# Altium project RFSoC-AMC.PrjPCB (part 22 of 22)
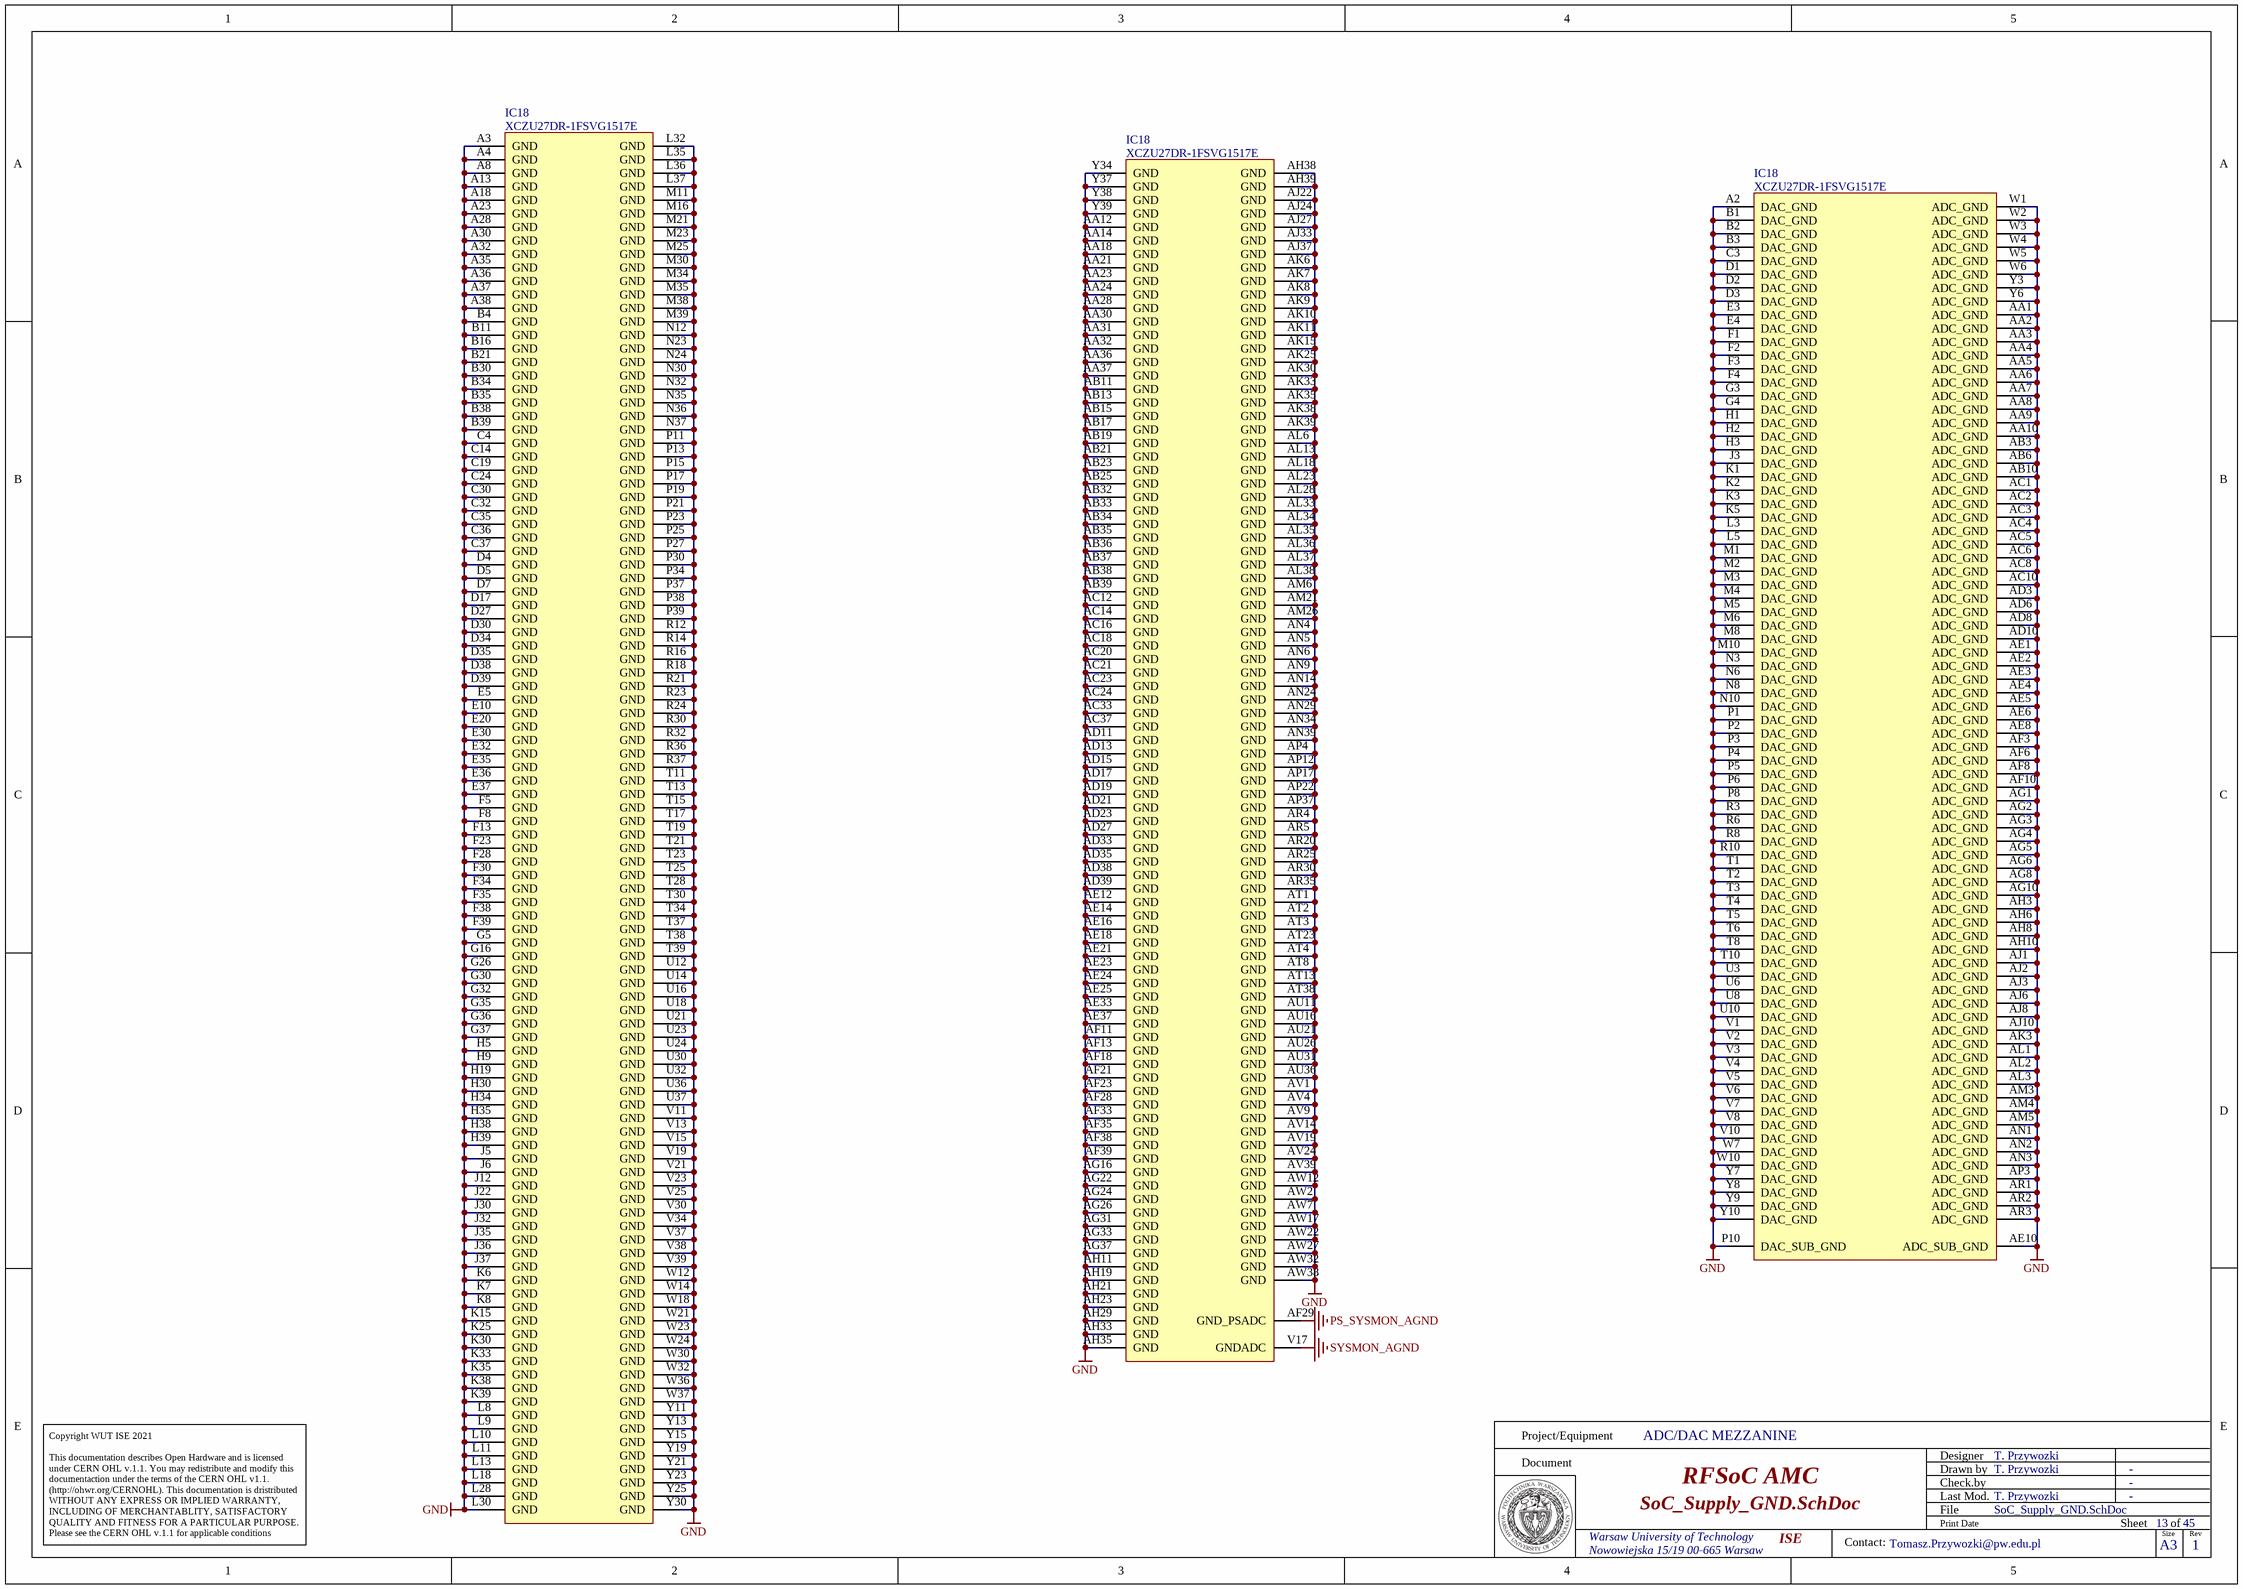
[diagram p48: SoC_Supply_GND.SchDoc]

## Nets that join several sheets (continued)
GTP8TX_N: RTM_Connector (J5.f2), SoC_FPGA_128-131_GTY (C492.2)
GTP8TX_P: RTM_Connector (J5.e2), SoC_FPGA_128-131_GTY (C494.2)
GTP9RX_N: RTM_Connector (J5.d1), SoC_FPGA_128-131_GTY (C463.2)
GTP9RX_P: RTM_Connector (J5.c1), SoC_FPGA_128-131_GTY (C464.2)
GTP9TX_N: RTM_Connector (J5.f1), SoC_FPGA_128-131_GTY (C465.2)
GTP9TX_P: RTM_Connector (J5.e1), SoC_FPGA_128-131_GTY (C466.2)
GTP10RX_N: RTM_Connector (J4.d10), SoC_FPGA_128-131_GTY (C459.2)
GTP10RX_P: RTM_Connector (J4.c10), SoC_FPGA_128-131_GTY (C460.2)
GTP10TX_N: RTM_Connector (J4.f10), SoC_FPGA_128-131_GTY (C461.2)
GTP10TX_P: RTM_Connector (J4.e10), SoC_FPGA_128-131_GTY (C462.2)
GTP11RX_N: RTM_Connector (J4.d9), SoC_FPGA_128-131_GTY (C324.2)
GTP11RX_P: RTM_Connector (J4.c9), SoC_FPGA_128-131_GTY (C338.2)
GTP11TX_N: RTM_Connector (J4.f9), SoC_FPGA_128-131_GTY (C456.2)
GTP11TX_P: RTM_Connector (J4.e9), SoC_FPGA_128-131_GTY (C458.2)
GTP12-15_CLK_IN_N: RTM_Connector (J4.b7), SoC_FPGA_128-131_GTY (C862.2)
GTP12-15_CLK_IN_P: RTM_Connector (J4.a7), SoC_FPGA_128-131_GTY (C864.2)
GTP12-15_CLK_OUT_N: RTM_Connector (J4.b8), SoC_FPGA_128-131_GTY (IC23.2)
GTP12-15_CLK_OUT_P: RTM_Connector (J4.a8), SoC_FPGA_128-131_GTY (IC23.1)
GTP12RX_N: RTM_Connector (J4.d8), SoC_FPGA_128-131_GTY (C508.1)
GTP12RX_P: RTM_Connector (J4.c8), SoC_FPGA_128-131_GTY (C511.1)
GTP12TX_N: RTM_Connector (J4.f8), SoC_FPGA_128-131_GTY (C509.1)
GTP12TX_P: RTM_Connector (J4.e8), SoC_FPGA_128-131_GTY (C512.1)
GTP13RX_N: RTM_Connector (J4.d7), SoC_FPGA_128-131_GTY (C515.1)
GTP13RX_P: RTM_Connector (J4.c7), SoC_FPGA_128-131_GTY (C517.1)
GTP13TX_N: RTM_Connector (J4.f7), SoC_FPGA_128-131_GTY (C516.1)
GTP13TX_P: RTM_Connector (J4.e7), SoC_FPGA_128-131_GTY (C518.1)
GTP14RX_N: RTM_Connector (J4.d6), SoC_FPGA_128-131_GTY (C519.1)
GTP14RX_P: RTM_Connector (J4.c6), SoC_FPGA_128-131_GTY (C521.1)
GTP14TX_N: RTM_Connector (J4.f6), SoC_FPGA_128-131_GTY (C520.1)
GTP14TX_P: RTM_Connector (J4.e6), SoC_FPGA_128-131_GTY (C765.1)
GTP15RX_N: RTM_Connector (J4.d5), SoC_FPGA_128-131_GTY (C321.2)
GTP15RX_P: RTM_Connector (J4.c5), SoC_FPGA_128-131_GTY (C326.2)
GTP15TX_N: RTM_Connector (J4.f5), SoC_FPGA_128-131_GTY (C455.2)
GTP15TX_P: RTM_Connector (J4.e5), SoC_FPGA_128-131_GTY (C457.2)
GTR_REF_N: SoC_PS_505_GTR (IC38.10), Clocking_SI5341B (IC83.53)
GTR_REF_P: SoC_PS_505_GTR (IC38.11), Clocking_SI5341B (IC83.54)
GTY_REF_128_N: SoC_FPGA_128-131_GTY (IC29.10), Clocking_SI5341B (IC83.30)
GTY_REF_128_P: SoC_FPGA_128-131_GTY (IC29.11), Clocking_SI5341B (IC83.31)
GTY_REF_129_N: SoC_FPGA_128-131_GTY (IC36.10), Clocking_SI5341B (IC83.34)
GTY_REF_129_P: SoC_FPGA_128-131_GTY (IC36.11), Clocking_SI5341B (IC83.35)
GTY_REF_130_N: SoC_FPGA_128-131_GTY (IC23.10), Clocking_SI5341B (IC83.37)
GTY_REF_130_P: SoC_FPGA_128-131_GTY (IC23.11), Clocking_SI5341B (IC83.38)
GTY_REF_131_N: SoC_FPGA_128-131_GTY (C370.1), Clocking_SI5341B (IC83.41)
GTY_REF_131_P: SoC_FPGA_128-131_GTY (C368.1), Clocking_SI5341B (IC83.42)
Helper_DCXO_N: CDR_WR_oscillators (R506.2), FPGA_7A35T (IC84.C13 R696.2)
Helper_DCXO_OE: CDR_WR_oscillators (R507.2 R511.2), FPGA_7A35T (IC84.M16)
Helper_DCXO_P: CDR_WR_oscillators (R298.2), FPGA_7A35T (IC84.D13 R695.2)
Helper_DCXO_SCL: CDR_WR_oscillators (OSC3.8 R502.1 TP76.1), FPGA_7A35T (IC84.U14)
Helper_DCXO_SDA: CDR_WR_oscillators (OSC3.7 R501.1 TP75.1), FPGA_7A35T (IC84.V14)
I2C_MUX_ADDR1: CPU_LPC1776_1 (IC24.L1), I2C_MUX (R309.1 R344.1)
I2C_MUX_ADDR2: CPU_LPC1776_1 (IC24.M2), I2C_MUX (R307.1 R342.1)
I2C_MUX_ADDR3: CPU_LPC1776_1 (IC24.P2), I2C_MUX (R335.2)
I2C_MUX_ADDR4: CPU_LPC1776_1 (IC24.P1), I2C_MUX (R330.2)
I2C_RTM_EN: CPU_LPC1776_1 (IC24.F14), I2C_MUX (IC80.1 R382.1)
I2C_SW_FPGA_RESETn: I2C_MUX (IC32.24 R327.1), FPGA_7A35T (IC84.R15)
I2C_SW_RESETn: CPU_LPC1776_1 (IC24.E5 R197.2), I2C_MUX (IC33.24)
IN_SEL0: SoC_FPGA_HD_84_87 (IC18.AT7), Clocking_SI5341B (IC83.3)
IN_SEL1: SoC_FPGA_HD_84_87 (IC18.AT6), Clocking_SI5341B (IC83.4)
IPMB_SCL: AMC_Connector (P1.56), CPU_LPC1776_1 (D5.1 IC24.M1 R201.2)
IPMB_SDA: AMC_Connector (P1.71), CPU_LPC1776_1 (D4.1 IC24.L3 R200.2)
ISP_RSTn: CPU_LPC1776_2 (SW2.1), USB_SERIAL_QUAD (IC58.5)
LMK_CLK: AMS_CLOCK (R59.2), FPGA_7A35T (IC84.N17)
LMK_DATA: AMS_CLOCK (R60.2), FPGA_7A35T (IC84.N16)
LMK_LE: AMS_CLOCK (R58.2), FPGA_7A35T (IC84.N18)
LMK_MUXOUT: AMS_CLOCK (IC8.27), FPGA_7A35T (IC84.P18)
LMX2594A: U_ADC_PLL (R171_U_ADC_PLL#1.1), AMS_CLOCK (R83.2)
LMX2594A_SYNC: U_ADC_PLL (R171_U_ADC_PLL#2.1), AMS_CLOCK (R84.2)
LMX2594C: DAC_PLL (R97.1), AMS_CLOCK (R85.2)
LPC_ISP_SWn: CPU_LPC1776_1 (IC24.M13), CPU_LPC1776_2 (IC44.2 R351.2 SW2.7)
LPC_ISPn: CPU_LPC1776_2 (SW2.2), USB_SERIAL_QUAD (IC58.4)
LTM4677_ALERT: CPU_LPC1776_1 (IC24.E7), Supply_CORE (IC14.E5 R144.1)
LVDS0_N: RTM_Connector (J4.f3), FPGA_7A35T (IC84.C8)
LVDS0_P: RTM_Connector (J4.e3), FPGA_7A35T (IC84.D8)
LVDS1_N: RTM_Connector (J4.f4), FPGA_7A35T (IC84.C9)
LVDS1_P: RTM_Connector (J4.e4), FPGA_7A35T (IC84.D9)
LVDS2_N: RTM_Connector (J4.d4), FPGA_7A35T (IC84.A9)
LVDS2_P: RTM_Connector (J4.c4), FPGA_7A35T (IC84.B9)
LVDS3_N: RTM_Connector (J5.b3), FPGA_7A35T (IC84.C18)
LVDS3_P: RTM_Connector (J5.a3), FPGA_7A35T (IC84.C17)
LVDS4_N: RTM_Connector (J5.b4), FPGA_7A35T (IC84.B17)
LVDS4_P: RTM_Connector (J5.a4), FPGA_7A35T (IC84.C16)
LVDS5_N: RTM_Connector (J5.b7), FPGA_7A35T (IC84.C12)
LVDS5_P: RTM_Connector (J5.a7), FPGA_7A35T (IC84.D11)
LVDS6_N: RTM_Connector (J5.b8), FPGA_7A35T (IC84.B11)
LVDS6_P: RTM_Connector (J5.a8), FPGA_7A35T (IC84.C11)
LVDS7_N: RTM_Connector (J4.b5), FPGA_7A35T (IC84.A10)
LVDS7_P: RTM_Connector (J4.a5), FPGA_7A35T (IC84.B10)
LVDS8_N: RTM_Connector (J4.b6), FPGA_7A35T (IC84.A12)
LVDS8_P: RTM_Connector (J4.a6), FPGA_7A35T (IC84.B12)
LVDS9_N: RTM_Connector (J4.b9), FPGA_7A35T (IC84.A14)
LVDS9_P: RTM_Connector (J4.a9), FPGA_7A35T (IC84.A13)
LVDS10_N: RTM_Connector (J4.b10), FPGA_7A35T (IC84.A17)
LVDS10_P: RTM_Connector (J4.a10), FPGA_7A35T (IC84.B16)
Main_DCXO_OE: CDR_WR_oscillators (R481.2 R493.2), FPGA_7A35T (IC84.M17)
Main_DCXO_SCL: CDR_WR_oscillators (OSC2.8 R477.1 TP74.1), FPGA_7A35T (IC84.U16)
Main_DCXO_SDA: CDR_WR_oscillators (OSC2.7 R476.1 TP73.1), FPGA_7A35T (IC84.U15)
MII1_COL: ETH_PHY_SW_L2L3 (R242.2), CPU_LPC1776_1 (IC24.C13)
MII1_CRS: ETH_PHY_SW_L2L3 (R241.2), CPU_LPC1776_1 (IC24.B6)
MII1_INT: ETH_PHY_SW_L2L3 (IC26.56 R288.2), CPU_LPC1776_1 (IC24.L5)
MII1_MDC: ETH_PHY_SW_L2L3 (IC26.55 IC47.8 R281.2), CPU_LPC1776_1 (IC24.B8)
MII1_MDIO: ETH_PHY_SW_L2L3 (IC26.54 IC47.1 R285.2), CPU_LPC1776_1 (IC24.C9)
MII1_MODE: ETH_PHY_SW_L2L3 (R254.2), CPU_LPC1776_1 (IC24.N1)
MII1_RX_CLK: ETH_PHY_SW_L2L3 (R245.2), CPU_LPC1776_1 (IC24.A8)
MII1_RX_DV: ETH_PHY_SW_L2L3 (R244.2), CPU_LPC1776_1 (IC24.D14)
MII1_RX_ER: ETH_PHY_SW_L2L3 (R234.2), CPU_LPC1776_1 (IC24.D8)
MII1_RXD0: ETH_PHY_SW_L2L3 (R253.2), CPU_LPC1776_1 (IC24.D7)
MII1_RXD1: ETH_PHY_SW_L2L3 (R251.2), CPU_LPC1776_1 (IC24.A7)
MII1_RXD2: ETH_PHY_SW_L2L3 (R249.2), CPU_LPC1776_1 (IC24.A12)
MII1_RXD3: ETH_PHY_SW_L2L3 (R247.2), CPU_LPC1776_1 (IC24.A14)
MII1_TX_CLK: ETH_PHY_SW_L2L3 (R235.2), CPU_LPC1776_1 (IC24.B10)
MII1_TX_EN: ETH_PHY_SW_L2L3 (R240.2), CPU_LPC1776_1 (IC24.C6)
MII1_TXD0: ETH_PHY_SW_L2L3 (R239.2), CPU_LPC1776_1 (IC24.B5)
MII1_TXD1: ETH_PHY_SW_L2L3 (R238.2), CPU_LPC1776_1 (IC24.A5)
MII1_TXD2: ETH_PHY_SW_L2L3 (R237.2), CPU_LPC1776_1 (IC24.B7)
MII1_TXD3: ETH_PHY_SW_L2L3 (R236.2), CPU_LPC1776_1 (IC24.A9)
MIO18_UART0_RXD: USB_SERIAL_QUAD (R636.1), SoC_PS_500_501_502_MIO (IC18.Y27)
MIO19_UART0_TXD: USB_SERIAL_QUAD (R638.1), SoC_PS_500_501_502_MIO (IC18.W28)
MISO_ADC0: U_ADC_PLL (DS3_U_ADC_PLL#1.2 IC21_U_ADC_PLL#1.20), FPGA_7A35T (IC84.J18)
MISO_ADC1: U_ADC_PLL (DS3_U_ADC_PLL#2.2 IC21_U_ADC_PLL#2.20), FPGA_7A35T (IC84.U17)
MISO_DAC: DAC_PLL (DS2.2 U2.20), FPGA_7A35T (IC84.J15)
MLVDS_DE_1: MLVDS_Transceivers (IC51.1 R297.2), SoC_FPGA_HD_84_87 (IC18.B5)
MLVDS_DE_2: MLVDS_Transceivers (IC51.2 R464.2), SoC_FPGA_HD_84_87 (IC18.A5)
MLVDS_DE_3: MLVDS_Transceivers (IC51.3 R465.2), SoC_FPGA_HD_84_87 (IC18.C5)
MLVDS_DE_4: MLVDS_Transceivers (IC51.4 R524.2), SoC_FPGA_HD_84_87 (IC18.C6)
MLVDS_DE_5: MLVDS_Transceivers (IC51.29 R671.2), SoC_FPGA_HD_84_87 (IC18.E7)
MLVDS_DE_6: MLVDS_Transceivers (IC51.30 R672.2), SoC_FPGA_HD_84_87 (IC18.E9)
MLVDS_DE_7: MLVDS_Transceivers (IC51.31 R673.2), SoC_FPGA_HD_84_87 (IC18.E8)
MLVDS_DE_8: MLVDS_Transceivers (IC51.32 R674.2), SoC_FPGA_HD_84_87 (IC18.F6)
MLVDS_I_1: MLVDS_Transceivers (IC51.59), SoC_FPGA_HD_84_87 (IC18.A6)
MLVDS_I_2: MLVDS_Transceivers (IC51.56), SoC_FPGA_HD_84_87 (IC18.A7)
MLVDS_I_3: MLVDS_Transceivers (IC51.53), SoC_FPGA_HD_84_87 (IC18.B7)
MLVDS_I_4: MLVDS_Transceivers (IC51.50), SoC_FPGA_HD_84_87 (IC18.C8)
MLVDS_I_5: MLVDS_Transceivers (IC51.47), SoC_FPGA_HD_84_87 (IC18.A9)
MLVDS_I_6: MLVDS_Transceivers (IC51.44), SoC_FPGA_HD_84_87 (IC18.A10)
MLVDS_I_7: MLVDS_Transceivers (IC51.41), SoC_FPGA_HD_84_87 (IC18.B10)
MLVDS_I_8: MLVDS_Transceivers (IC51.38), SoC_FPGA_HD_84_87 (IC18.D10)
MLVDS_O_1: MLVDS_Transceivers (IC51.58), SoC_FPGA_HD_84_87 (IC18.D6)
MLVDS_O_2: MLVDS_Transceivers (IC51.57), SoC_FPGA_HD_84_87 (IC18.E6)
MLVDS_O_3: MLVDS_Transceivers (IC51.52), SoC_FPGA_HD_84_87 (IC18.C7)
MLVDS_O_4: MLVDS_Transceivers (IC51.51), SoC_FPGA_HD_84_87 (IC18.B8)
MLVDS_O_5: MLVDS_Transceivers (IC51.46), SoC_FPGA_HD_84_87 (IC18.B9)
MLVDS_O_6: MLVDS_Transceivers (IC51.45), SoC_FPGA_HD_84_87 (IC18.D9)
MLVDS_O_7: MLVDS_Transceivers (IC51.40), SoC_FPGA_HD_84_87 (IC18.D8)
MLVDS_O_8: MLVDS_Transceivers (IC51.39), SoC_FPGA_HD_84_87 (IC18.C10)
MLVDS_RE: MLVDS_Transceivers (IC51.33 R675.2), SoC_FPGA_HD_84_87 (IC18.AP6)
MMC_CONS_PROG_RxD: CPU_LPC1776_1 (IC24.A3), USB_SERIAL_QUAD (IC53.5)
MMC_CONS_PROG_TxD: CPU_LPC1776_1 (IC24.D5), USB_SERIAL_QUAD (IC53.4)
MMC_FPGA_DONE: CPU_LPC1776_1 (IC24.B11), SoC_PS_Config_503 (IC18.AB27 R585.1 T15.1)
MMC_FPGA_INIT_B: CPU_LPC1776_1 (IC24.J5), SoC_PS_Config_503 (IC18.AB26 R594.1 T14.1)
MMC_FPGA_PROG_B: CPU_LPC1776_1 (IC24.A11), SoC_PS_Config_503 (IC18.AA27 R584.1)
MMC_MISO1: CPU_LPC1776_1 (IC24.C12), SoC_FPGA_67_68_69_DDR4 (IC46.4)
MMC_MOSI1: CPU_LPC1776_1 (IC24.A13), SoC_FPGA_67_68_69_DDR4 (IC45.5)
MMC_SCK1: CPU_LPC1776_1 (IC24.B12), SoC_FPGA_67_68_69_DDR4 (IC46.5)
MMC_SCL: CPU_LPC1776_1 (IC24.N11 IC78.19), I2C_MUX (IC33.19 R332.1 TP60.1)
MMC_SDA: CPU_LPC1776_1 (IC24.M10 IC78.20), I2C_MUX (IC33.20 R331.1 TP58.1)
MMC_SSEL1: CPU_LPC1776_1 (IC24.D11), SoC_FPGA_67_68_69_DDR4 (IC45.4)
MMC_TCK: CPU_LPC1776_2 (R225.2), JTAG_Configuration (IC34.11)
MMC_TDI: CPU_LPC1776_2 (R224.2), JTAG_Configuration (IC34.2)
MMC_TDO: CPU_LPC1776_2 (R223.2), JTAG_Configuration (IC34.5)
MMC_TMS: CPU_LPC1776_2 (R222.2), JTAG_Configuration (IC34.14)
MMC_TRSTn: CPU_LPC1776_2 (R221.2), JTAG_Configuration (R361.1)
MOD_HANDLE: soc (PB1.1 PB1.2), CPU_LPC1776_1 (IC24.B14 R193.1)
MOSI: U_ADC_PLL (R168_U_ADC_PLL#1.2), DAC_PLL (R94.2), U_ADC_PLL (R168_U_ADC_PLL#2.2), FPGA_7A35T (IC84.L14)
NetC815_2: Thermometers (C815.2 C816.2 IC68.3), FPGA_7A35T (IC84.M10)
NetD6_1: RTM_Connector (J4.c1), CPU_LPC1776_1 (D6.1 R202.1 R203.1), JTAG_Configuration (R371.2)
NetD27_2: CPU_LPC1776_1 (IC24.D12), JTAG_Configuration (D27.2)
NetIC5_U_DDR4_SDRAM_PL1_9: U_DDR4_SDRAM_PL1 (IC5_U_DDR4_SDRAM_PL1.9), U_DDR4_SDRAM_PL2 (IC5_U_DDR4_SDRAM_PL2.9), U_DDR4_SDRAM_PS (IC5_U_DDR4_SDRAM_PS.9), CPU_LPC1776_1 (IC24.C14 R37.1)
NetIC11_C2: CPU_LPC1776_1 (IC24.G3), Supply (5 pins)
NetIC12_C2: CPU_LPC1776_1 (IC24.A4), Supply (5 pins)
NetIC13_C2: CPU_LPC1776_1 (IC24.A6), Supply (5 pins)
NetIC14_E4: CPU_LPC1776_1 (IC24.C7), Supply_CORE (IC14.E4 IC14.F4 R142.1)
NetIC14_F5: CPU_LPC1776_1 (IC24.B9), Supply_CORE (IC14.F5 IC14.F6 R143.1)
NetIC18_AB29: CPU_LPC1776_1 (IC24.C4), SoC_PS_Config_503 (IC18.AB29 R470.1), SoC_PS_500_501_502_MIO (IC62.1)
NetIC18_AR6: USB_SERIAL_QUAD (R634.1), SoC_FPGA_HD_84_87 (IC18.AR6)
NetIC18_AR7: USB_SERIAL_QUAD (R633.1), SoC_FPGA_HD_84_87 (IC18.AR7)
NetIC18_AT5: SoC_FPGA_HD_84_87 (IC18.AT5), Clocking_SI5341B (IC83.6 R678.1)
NetIC18_AU5: I2C_MUX (IC30.24 R306.2), SoC_FPGA_HD_84_87 (IC18.AU5)
NetIC24_B3: CPU_LPC1776_1 (IC24.B3), VCCINT_IO_BRAM_PS (5 pins)
NetIC24_F10: soc (PB2.1), CPU_LPC1776_1 (IC24.F10 R192.1)
NetIC24_F11: CPU_LPC1776_1 (IC24.F11), Thermometers (7 pins)
NetIC84_M9: Thermometers (R609.1), FPGA_7A35T (IC84.M9)
P12V0_OK: CPU_LPC1776_1 (IC24.B2), Power_Management_RFMC_RTM (IC43.1 R409.1)
PGOOD_ADC_AVCC: CPU_LPC1776_1 (IC24.F1), ADC_DAC_Supply (IC17.6 R329.1)
PGOOD_AMS_CLK_P3V3: CPU_LPC1776_1 (IC24.A1), Supply_LDOs (IC7.4 R326.1)
PGOOD_DAC_AVCC: CPU_LPC1776_1 (IC24.H11), ADC_DAC_Supply (IC19.6 R333.1)
PGOOD_DAC_AVCCAUX: CPU_LPC1776_1 (IC24.G14), ADC_DAC_Supply (IC20.6 R383.1)
PGOOD_MGT1V8: CPU_LPC1776_1 (IC24.C1), Supply_LDOs (IC15.6 R321.1)
PGOOD_MGTRAVCC: CPU_LPC1776_1 (IC24.G11), Supply_LDOs (IC16.6 R328.1)
PGOOD_P5V0: CPU_LPC1776_1 (IC24.G4), Power_Management_RFMC_RTM (IC41.C2 R401.2)
PHY_RESETn: ETH_PHY_SW_L2L3 (IC26.103), CPU_LPC1776_1 (IC24.F5)
PM_SCL: I2C_MUX (IC30.13 IC32.13 IC33.13 R317.2), Power_Management_RFMC_RTM (IC40.5)
PM_SDA: I2C_MUX (IC30.12 IC32.12 IC33.12 R316.2), Power_Management_RFMC_RTM (IC40.6)
PS_SRST: CPU_LPC1776_1 (IC24.H12 R196.2), SoC_FPGA_HD_84_87 (IC18.AU4), SoC_PS_Config_503 (IC18.AB28), SoC_PS_500_501_502_MIO (IC62.2)
REFIN_2594A_N: U_ADC_PLL (C322_U_ADC_PLL#1.1 R164_U_ADC_PLL#1.2), AMS_CLOCK (IC9.18)
REFIN_2594A_N: U_ADC_PLL (C322_U_ADC_PLL#2.1 R164_U_ADC_PLL#2.2), AMS_CLOCK (IC9.21)
REFIN_2594A_P: U_ADC_PLL (C319_U_ADC_PLL#1.1 R164_U_ADC_PLL#1.1), AMS_CLOCK (IC9.19)
REFIN_2594A_P: U_ADC_PLL (C319_U_ADC_PLL#2.1 R164_U_ADC_PLL#2.1), AMS_CLOCK (IC9.22)
REFIN_2594C_N: DAC_PLL (C184.1 R90.2), AMS_CLOCK (IC9.7)
REFIN_2594C_P: DAC_PLL (C181.1 R90.1), AMS_CLOCK (IC9.6)
RF1_CLKO_A_C_N: U_ADC_PLL (C224_U_ADC_PLL#1.1 C320_U_ADC_PLL#1.2), SoC_224-229_ADC_DAC (IC18.AF4)
RF1_CLKO_A_C_N: U_ADC_PLL (C224_U_ADC_PLL#2.1 C320_U_ADC_PLL#2.2), SoC_224-229_ADC_DAC (IC18.AB4)
RF1_CLKO_A_C_P: U_ADC_PLL (C91_U_ADC_PLL#1.1 C314_U_ADC_PLL#1.2), SoC_224-229_ADC_DAC (IC18.AF5)
RF1_CLKO_A_C_P: U_ADC_PLL (C91_U_ADC_PLL#2.1 C314_U_ADC_PLL#2.2), SoC_224-229_ADC_DAC (IC18.AB5)
RF1_CLKO_B_C_N: U_ADC_PLL (C337_U_ADC_PLL#1.2 C769_U_ADC_PLL#1.1), SoC_224-229_ADC_DAC (IC18.AD4)
RF1_CLKO_B_C_N: U_ADC_PLL (C337_U_ADC_PLL#2.2 C769_U_ADC_PLL#2.1), SoC_224-229_ADC_DAC (IC18.Y4)
RF1_CLKO_B_C_P: U_ADC_PLL (C227_U_ADC_PLL#1.1 C323_U_ADC_PLL#1.2), SoC_224-229_ADC_DAC (IC18.AD5)
RF1_CLKO_B_C_P: U_ADC_PLL (C227_U_ADC_PLL#2.1 C323_U_ADC_PLL#2.2), SoC_224-229_ADC_DAC (IC18.Y5)
RF3_CLKO_A_C_N: DAC_PLL (C88.1 C182.2), SoC_224-229_ADC_DAC (IC18.R4)
RF3_CLKO_A_C_P: DAC_PLL (C87.1 C176.2), SoC_224-229_ADC_DAC (IC18.R5)
RF3_CLKO_B_C_N: DAC_PLL (C90.1 C199.2), SoC_224-229_ADC_DAC (IC18.N4)
RF3_CLKO_B_C_P: DAC_PLL (C89.1 C185.2), SoC_224-229_ADC_DAC (IC18.N5)
RFMC_I2C_SCL: RFMC_ADC (J1.g6), I2C_MUX (IC30.6 IC32.6 IC33.6 R310.2)
RFMC_I2C_SDA: RFMC_ADC (J1.e6), I2C_MUX (IC30.5 IC32.5 IC33.5 R308.2)
RFSoC_Artix_0_N: SoC_FPGA_64_65_66_DDR4 (C767.2), FPGA_7A35T (IC84.E18 R665.2)
RFSoC_Artix_0_P: SoC_FPGA_64_65_66_DDR4 (C764.2), FPGA_7A35T (IC84.F17 R600.2)
RFSoC_Artix_1_N: SoC_FPGA_64_65_66_DDR4 (C763.2), FPGA_7A35T (IC84.H18 R581.2)
RFSoC_Artix_1_P: SoC_FPGA_64_65_66_DDR4 (C762.2), FPGA_7A35T (IC84.H17 R543.2)
RFSoC_Artix_2_N: SoC_FPGA_64_65_66_DDR4 (C761.2), FPGA_7A35T (IC84.F14 R542.2)
RFSoC_Artix_2_P: SoC_FPGA_64_65_66_DDR4 (C760.2), FPGA_7A35T (IC84.G14 R532.2)
RFSoC_Artix_3_N: SoC_FPGA_64_65_66_DDR4 (C759.2), FPGA_7A35T (IC84.F18 R530.2)
RFSoC_Artix_3_P: SoC_FPGA_64_65_66_DDR4 (C758.2), FPGA_7A35T (IC84.G17 R525.2)
RGMII1_RX_CLK: ETH_PHY_SW_L2L3 (R259.2), SoC_PS_500_501_502_MIO (IC18.A26)
RGMII1_RX_CTL: ETH_PHY_SW_L2L3 (R264.2), SoC_PS_500_501_502_MIO (IC18.F26)
RGMII1_RXD0: ETH_PHY_SW_L2L3 (R280.2), SoC_PS_500_501_502_MIO (IC18.A27)
RGMII1_RXD1: ETH_PHY_SW_L2L3 (R276.2), SoC_PS_500_501_502_MIO (IC18.B27)
RGMII1_RXD2: ETH_PHY_SW_L2L3 (R274.2), SoC_PS_500_501_502_MIO (IC18.E26)
RGMII1_RXD3: ETH_PHY_SW_L2L3 (R272.2), SoC_PS_500_501_502_MIO (IC18.C27)
RGMII1_TX_CLK: ETH_PHY_SW_L2L3 (IC26.90), SoC_PS_500_501_502_MIO (R551.1)
RGMII1_TX_CTL: ETH_PHY_SW_L2L3 (IC26.91), SoC_PS_500_501_502_MIO (R556.1)
RGMII1_TXD0: ETH_PHY_SW_L2L3 (IC26.92), SoC_PS_500_501_502_MIO (R552.1)
RGMII1_TXD1: ETH_PHY_SW_L2L3 (IC26.93), SoC_PS_500_501_502_MIO (R553.1)
RGMII1_TXD2: ETH_PHY_SW_L2L3 (IC26.94), SoC_PS_500_501_502_MIO (R554.1)
RGMII1_TXD3: ETH_PHY_SW_L2L3 (IC26.95), SoC_PS_500_501_502_MIO (R555.1)
RGMII2_MDC: ETH_PHY_SW_L2L3 (IC47.5 R256.1), SoC_PS_500_501_502_MIO (IC18.M29)
RGMII2_MDIO: ETH_PHY_SW_L2L3 (IC47.4 R255.1), SoC_PS_500_501_502_MIO (IC18.L29)
RGMII2_RX_CLK: ETH_PHY_SW_L2L3 (R262.2), SoC_PS_500_501_502_MIO (IC18.K28)
RGMII2_RX_CTL: ETH_PHY_SW_L2L3 (R261.2), SoC_PS_500_501_502_MIO (IC18.N28)
RGMII2_RXD0: ETH_PHY_SW_L2L3 (R295.2), SoC_PS_500_501_502_MIO (IC18.H28)
RGMII2_RXD1: ETH_PHY_SW_L2L3 (R290.2), SoC_PS_500_501_502_MIO (IC18.J29)
RGMII2_RXD2: ETH_PHY_SW_L2L3 (R287.2), SoC_PS_500_501_502_MIO (IC18.K29)
RGMII2_RXD3: ETH_PHY_SW_L2L3 (R283.2), SoC_PS_500_501_502_MIO (IC18.M28)
RGMII2_TX_CLK: ETH_PHY_SW_L2L3 (IC26.76), SoC_PS_500_501_502_MIO (R569.1)
RGMII2_TX_CTL: ETH_PHY_SW_L2L3 (IC26.77), SoC_PS_500_501_502_MIO (R580.1)
RGMII2_TXD0: ETH_PHY_SW_L2L3 (IC26.78), SoC_PS_500_501_502_MIO (R570.1)
RGMII2_TXD1: ETH_PHY_SW_L2L3 (IC26.79), SoC_PS_500_501_502_MIO (R573.1)
RGMII2_TXD2: ETH_PHY_SW_L2L3 (IC26.80), SoC_PS_500_501_502_MIO (R575.1)
RGMII2_TXD3: ETH_PHY_SW_L2L3 (IC26.81), SoC_PS_500_501_502_MIO (R577.1)
RTM_CLK_N: RTM_Connector (J4.d3), Clocking_SI5341B (IC83.2 R314.2)
RTM_CLK_P: RTM_Connector (J4.c3), Clocking_SI5341B (IC83.1 R314.1)
RTM_SCL: RTM_Connector (J4.d2), I2C_MUX (IC80.2 R381.1)
RTM_SDA: RTM_Connector (J4.d1), I2C_MUX (IC80.7 R380.1)
RTM_TCK: RTM_Connector (J4.e1), JTAG_Configuration (IC35.15)
RTM_TDI: RTM_Connector (J4.e2), JTAG_Configuration (IC37.1 R368.1)
RTM_TDO: RTM_Connector (J4.f1), JTAG_Configuration (IC37.3)
RTM_TMS: RTM_Connector (J4.f2), JTAG_Configuration (IC35.12)
RX0_N: ETH_PHY_SW_L2L3 (C405.1 C1007.1), AMC_Connector (P1.15)
RX0_P: ETH_PHY_SW_L2L3 (C404.1 C1005.1), AMC_Connector (P1.14)
RX0_SoC_N: ETH_PHY_SW_L2L3 (C1007.2), SoC_FPGA_128-131_GTY (C869.2)
RX0_SoC_P: ETH_PHY_SW_L2L3 (C1005.2), SoC_FPGA_128-131_GTY (C870.2)
RX1_N: ETH_PHY_SW_L2L3 (C409.1), AMC_Connector (P1.24)
RX1_P: ETH_PHY_SW_L2L3 (C408.1), AMC_Connector (P1.23)
Rx4_N: AMC_Connector (P1.48), SoC_FPGA_128-131_GTY (C878.2)
Rx4_P: AMC_Connector (P1.47), SoC_FPGA_128-131_GTY (C877.2)
Rx5_N: AMC_Connector (P1.54), SoC_FPGA_128-131_GTY (C882.2)
Rx5_P: AMC_Connector (P1.53), SoC_FPGA_128-131_GTY (C881.2)
Rx6_N: AMC_Connector (P1.63), SoC_FPGA_128-131_GTY (C916.2)
Rx6_P: AMC_Connector (P1.62), SoC_FPGA_128-131_GTY (C915.2)
Rx7_N: AMC_Connector (P1.69), SoC_FPGA_128-131_GTY (C920.2)
Rx7_P: AMC_Connector (P1.68), SoC_FPGA_128-131_GTY (C919.2)
Rx8_N: AMC_Connector (P1.87), FPGA_7A35T_GTP (C1013.1)
Rx8_P: AMC_Connector (P1.88), FPGA_7A35T_GTP (C1012.1)
Rx9_N: AMC_Connector (P1.93), FPGA_7A35T_GTP (C1017.1)
Rx9_P: AMC_Connector (P1.94), FPGA_7A35T_GTP (C1016.1)
Rx10_N: AMC_Connector (P1.99), FPGA_7A35T_GTP (C1021.1)
Rx10_P: AMC_Connector (P1.100), FPGA_7A35T_GTP (C1020.1)
Rx11_N: AMC_Connector (P1.105), FPGA_7A35T_GTP (C1025.1)
Rx11_P: AMC_Connector (P1.106), FPGA_7A35T_GTP (C1024.1)
Rx17_N: AMC_Connector (P1.141), MLVDS_Transceivers (IC51.27)
Rx17_P: AMC_Connector (P1.142), MLVDS_Transceivers (IC51.26)
Rx18_N: AMC_Connector (P1.147), MLVDS_Transceivers (IC51.21)
Rx18_P: AMC_Connector (P1.148), MLVDS_Transceivers (IC51.20)
Rx19_N: AMC_Connector (P1.153), MLVDS_Transceivers (IC51.15)
Rx19_P: AMC_Connector (P1.154), MLVDS_Transceivers (IC51.14)
Rx20_N: AMC_Connector (P1.159), MLVDS_Transceivers (IC51.9)
Rx20_P: AMC_Connector (P1.160), MLVDS_Transceivers (IC51.8)
SCL1: I2C_MUX (IC30.4 IC32.4 IC33.4 R305.2), Clocking_SI5341B (IC83.16)
SCL3: I2C_MUX (IC30.8 IC32.8 IC33.8 R313.2), Thermometers (8 pins)
SCL4: I2C_MUX (IC30.11 IC32.11 IC33.11 R146.2), Supply_CORE (IC14.E6)
SDA1: I2C_MUX (IC30.3 IC32.3 IC33.3 R304.2), Clocking_SI5341B (IC83.18)
SDA3: I2C_MUX (IC30.7 IC32.7 IC33.7 R312.2), Thermometers (8 pins)
SDA4: I2C_MUX (IC30.10 IC32.10 IC33.10 R145.2), Supply_CORE (IC14.D6)
SDIO_CLK: SD_CARD (IC48.9), SoC_PS_500_501_502_MIO (R562.1)
SDIO_CMD: SD_CARD (IC48.4), SoC_PS_500_501_502_MIO (R561.1)
SDIO_DAT0: SD_CARD (IC48.6), SoC_PS_500_501_502_MIO (R557.1)
SDIO_DAT1: SD_CARD (IC48.7), SoC_PS_500_501_502_MIO (R558.1)
SDIO_DAT2: SD_CARD (IC48.1), SoC_PS_500_501_502_MIO (R559.1)
SDIO_DAT3: SD_CARD (IC48.3), SoC_PS_500_501_502_MIO (R560.1)
SDIO_DETECT: SD_CARD (R452.1 R453.1 R454.1), SoC_PS_500_501_502_MIO (IC18.G27)
SDIO_SEL: SD_CARD (R424.1), SoC_PS_500_501_502_MIO (IC18.B28)
SI5341_CLK_IN_N: CDR_WR_oscillators (C578.2), Clocking_SI5341B (IC83.64 R492.2)
SI5341_CLK_IN_P: CDR_WR_oscillators (C577.2), Clocking_SI5341B (IC83.63 R492.1)
SPI_CLK: U_ADC_PLL (R169_U_ADC_PLL#1.2), DAC_PLL (R95.2), U_ADC_PLL (R169_U_ADC_PLL#2.2), FPGA_7A35T (IC84.K16)
SS_USB.SSRX_N: SoC_PS_505_GTR (C784.2), USB3_CON (L61.1)
SS_USB.SSRX_P: SoC_PS_505_GTR (C783.2), USB3_CON (L61.4)
SS_USB.SSTX_N: SoC_PS_505_GTR (C782.2), USB3_CON (L60.1)
SS_USB.SSTX_P: SoC_PS_505_GTR (C781.2), USB3_CON (L60.4)
SYSREF_RFSOC_C_N: AMS_CLOCK (C114.2), SoC_224-229_ADC_DAC (IC18.U4)
SYSREF_RFSOC_C_P: AMS_CLOCK (C113.2), SoC_224-229_ADC_DAC (IC18.U5)
TCLKA_N: AMC_Connector (P1.75), CDR_WR_oscillators (IC22.10)
TCLKA_P: AMC_Connector (P1.74), CDR_WR_oscillators (IC22.11)
TCLKB_N: AMC_Connector (P1.78), CDR_WR_oscillators (C574.1)
TCLKB_P: AMC_Connector (P1.77), CDR_WR_oscillators (C572.1)
TRACECLK: CPU_LPC1776_1 (IC24.F13), CPU_LPC1776_2 (J6.12)
TRACEDATA0: CPU_LPC1776_1 (IC24.F12), CPU_LPC1776_2 (J6.14)
TRACEDATA1: CPU_LPC1776_1 (IC24.E14), CPU_LPC1776_2 (J6.16)
TRACEDATA2: CPU_LPC1776_1 (IC24.E13), CPU_LPC1776_2 (J6.18)
TRACEDATA3: CPU_LPC1776_1 (IC24.E11), CPU_LPC1776_2 (J6.20)
TX0_N: ETH_PHY_SW_L2L3 (C407.1 C1029.1), AMC_Connector (P1.12)
TX0_P: ETH_PHY_SW_L2L3 (C406.1 C1028.1), AMC_Connector (P1.11)
TX0_SoC_N: ETH_PHY_SW_L2L3 (C1029.2), SoC_FPGA_128-131_GTY (C871.2)
TX0_SoC_P: ETH_PHY_SW_L2L3 (C1028.2), SoC_FPGA_128-131_GTY (C872.2)
TX1_N: ETH_PHY_SW_L2L3 (C411.1), AMC_Connector (P1.21)
TX1_P: ETH_PHY_SW_L2L3 (C410.1), AMC_Connector (P1.20)
Tx4_N: AMC_Connector (P1.45), SoC_FPGA_128-131_GTY (C879.2)
Tx4_P: AMC_Connector (P1.44), SoC_FPGA_128-131_GTY (C880.2)
Tx5_N: AMC_Connector (P1.51), SoC_FPGA_128-131_GTY (C883.2)
Tx5_P: AMC_Connector (P1.50), SoC_FPGA_128-131_GTY (C884.2)
Tx6_N: AMC_Connector (P1.60), SoC_FPGA_128-131_GTY (C917.2)
Tx6_P: AMC_Connector (P1.59), SoC_FPGA_128-131_GTY (C918.2)
Tx7_N: AMC_Connector (P1.66), SoC_FPGA_128-131_GTY (C921.2)
Tx7_P: AMC_Connector (P1.65), SoC_FPGA_128-131_GTY (C922.2)
Tx8_N: AMC_Connector (P1.90), FPGA_7A35T_GTP (C1014.1)
Tx8_P: AMC_Connector (P1.91), FPGA_7A35T_GTP (C1015.1)
Tx9_N: AMC_Connector (P1.96), FPGA_7A35T_GTP (C1018.1)
Tx9_P: AMC_Connector (P1.97), FPGA_7A35T_GTP (C1019.1)
Tx10_N: AMC_Connector (P1.102), FPGA_7A35T_GTP (C1022.1)
Tx10_P: AMC_Connector (P1.103), FPGA_7A35T_GTP (C1023.1)
Tx11_N: AMC_Connector (P1.108), FPGA_7A35T_GTP (C1026.1)
Tx11_P: AMC_Connector (P1.109), FPGA_7A35T_GTP (C1027.1)
Tx17_N: AMC_Connector (P1.144), MLVDS_Transceivers (IC51.25)
Tx17_P: AMC_Connector (P1.145), MLVDS_Transceivers (IC51.24)
Tx18_N: AMC_Connector (P1.150), MLVDS_Transceivers (IC51.19)
Tx18_P: AMC_Connector (P1.151), MLVDS_Transceivers (IC51.18)
Tx19_N: AMC_Connector (P1.156), MLVDS_Transceivers (IC51.13)
Tx19_P: AMC_Connector (P1.157), MLVDS_Transceivers (IC51.12)
Tx20_N: AMC_Connector (P1.162), MLVDS_Transceivers (IC51.7)
Tx20_P: AMC_Connector (P1.163), MLVDS_Transceivers (IC51.6)
ULPI0_RST_B: SoC_PS_500_501_502_MIO (R574.1 R578.1), USB_PHY (IC71.27)
USB_CLK: SoC_PS_500_501_502_MIO (IC18.N26), USB_PHY (IC71.1)
USB_D_R_N: USB3_CON (L58.1), USB_PHY (IC71.19)
USB_D_R_P: USB3_CON (L58.4), USB_PHY (IC71.18)
USB_DATA0: SoC_PS_500_501_502_MIO (R337.1), USB_PHY (IC71.3)
USB_DATA1: SoC_PS_500_501_502_MIO (R339.1), USB_PHY (IC71.4)
USB_DATA2: SoC_PS_500_501_502_MIO (R336.1), USB_PHY (IC71.5)
USB_DATA3: SoC_PS_500_501_502_MIO (R341.1), USB_PHY (IC71.6)
USB_DATA4: SoC_PS_500_501_502_MIO (R343.1), USB_PHY (IC71.7)
USB_DATA5: SoC_PS_500_501_502_MIO (R346.1), USB_PHY (IC71.9)
USB_DATA6: SoC_PS_500_501_502_MIO (R347.1), USB_PHY (IC71.10)
USB_DATA7: SoC_PS_500_501_502_MIO (R348.1), USB_PHY (IC71.13)
USB_DIR: SoC_PS_500_501_502_MIO (IC18.L25), USB_PHY (IC71.31)
USB_ID: USB3_CON (R613.1), USB_PHY (IC71.23)
USB_JTAG_ACTIVE: USB_SERIAL_QUAD (R625.2), JTAG_Configuration (T3.1)
USB_NXT: SoC_PS_500_501_502_MIO (IC18.J25), USB_PHY (IC71.2)
USB_PWR_EN: USB3_CON (IC70.1), USB_PHY (IC71.17)
USB_STP: SoC_PS_500_501_502_MIO (R340.1), USB_PHY (IC71.29)
USB_TCK: USB_SERIAL_QUAD (IC73.4), JTAG_Configuration (R362.2)
USB_TDI: USB_SERIAL_QUAD (IC73.5), JTAG_Configuration (R364.2)
USB_TDO: USB_SERIAL_QUAD (IC75.4), JTAG_Configuration (R365.2)
USB_TMS: USB_SERIAL_QUAD (IC75.5), JTAG_Configuration (R366.2)
USB_VBUS: USB3_CON (7 pins), USB_PHY (R614.2)
VCM01_224: RFMC_ADC (J1.a21), SoC_224-229_ADC_DAC (IC18.AL5)
VCM01_225: RFMC_ADC (J1.c21), SoC_224-229_ADC_DAC (IC18.AK5)
VCM01_226: RFMC_ADC (J1.e21), SoC_224-229_ADC_DAC (IC18.AJ5)
VCM01_227: RFMC_ADC (J1.g21), SoC_224-229_ADC_DAC (IC18.AH5)
VCM23_224: RFMC_ADC (J1.b21), SoC_224-229_ADC_DAC (IC18.AL4)
VCM23_225: RFMC_ADC (J1.d21), SoC_224-229_ADC_DAC (IC18.AK4)
VCM23_226: RFMC_ADC (J1.f21), SoC_224-229_ADC_DAC (IC18.AJ4)
VCM23_227: RFMC_ADC (J1.h21), SoC_224-229_ADC_DAC (IC18.AH4)
WR_CLK_SEL: CDR_WR_oscillators (IC52.32), FPGA_7A35T (IC84.M15)
WR_REF_CLK_IN_N: CDR_WR_oscillators (C574.2 C575.2), FPGA_7A35T (IC84.D16 R691.2)
WR_REF_CLK_IN_P: CDR_WR_oscillators (C572.2 C573.2), FPGA_7A35T (IC84.E16 R692.2)

## Assembly variants
Si549 CMOS: not fitted C87 C88 C89 C90 C91_U_ADC_PLL1 C91_U_ADC_PLL2 C139 C177 C178 C224_U_ADC_PLL1 C224_U_ADC_PLL2 C227_U_ADC_PLL1 C227_U_ADC_PLL2 C315_U_ADC_PLL1 C315_U_ADC_PLL2 C316_U_ADC_PLL1 C316_U_ADC_PLL2 C559 C559 C563 C563 C572 C574 C587 C769_U_ADC_PLL1 C769_U_ADC_PLL2 C923 C924 C925 C926 R65 R66 R67 R68 R92 R166_U_ADC_PLL1 R166_U_ADC_PLL2 R213 R214 R215 R216 R229 R267 R278 R350 R351 R373 R374 R375 R376 R380 R381 R397 R454 R456 R456 R466 R467 R485 R486 R493 R500 R503 R510 R511 R514 R515 R517 R518 R519 R520 R521 R537 R540 R617 R618 R652 R655 R657 R659 R666 R667 R668 R?; alternate parts R506 -> R0402_49R9_1%_0.0625W_100PPM